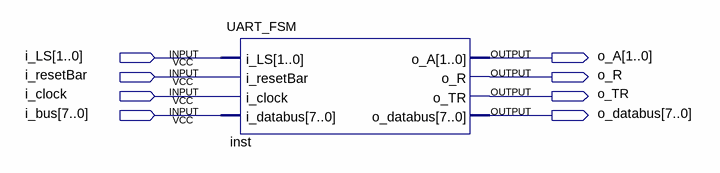
[diagram p0: schematic sheet]
// Quartus schematic Block4.bdf as structural Verilog: 1 symbols, 8 pins
module Block4 (
  input  [1:0] i_LS,
  input  i_resetBar,
  input  i_clock,
  input  [7:0] i_bus,
  output [1:0] o_A,
  output o_R,
  output o_TR,
  output [7:0] o_databus
);

  UART_FSM inst (
    .i_LS(i_LS), .i_resetBar(i_resetBar), .i_clock(i_clock), .i_databus(i_bus), .o_A(o_A), .o_R(o_R),
    .o_TR(o_TR), .o_databus(o_databus));
endmodule
